# EAGLE schematic diseño_eagle_v1.7 (EAGLE 9.6.2)
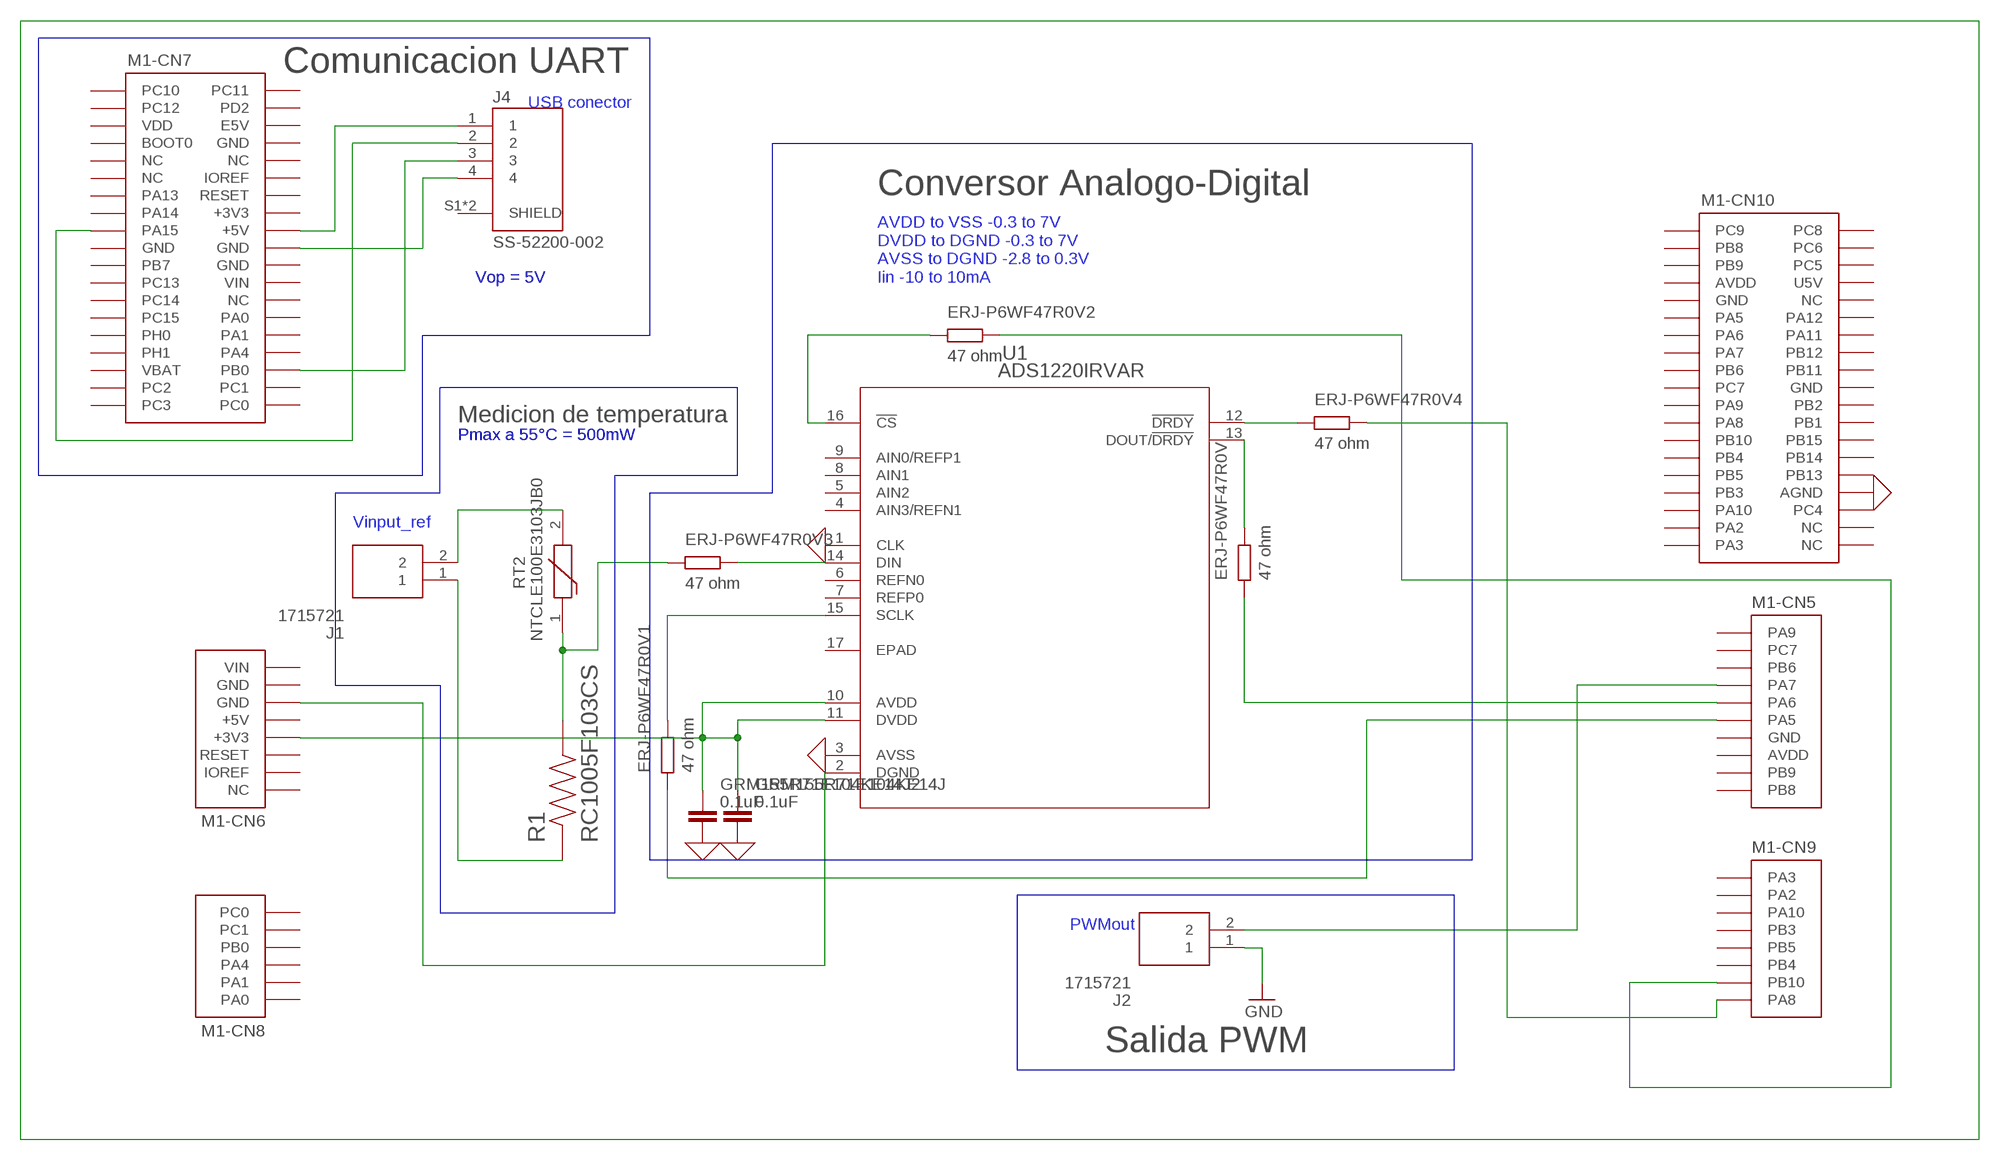
[diagram p0: schematic, sheet 1]

## Parts
ERJ-P6WF47R0V  47 ohm  R  (no package)
ERJ-P6WF47R0V1  47 ohm  R  (no package)
ERJ-P6WF47R0V2  47 ohm  R  (no package)
ERJ-P6WF47R0V3  47 ohm  R  (no package)
ERJ-P6WF47R0V4  47 ohm  R  (no package)
GRM155R71E104KE14J  0.1uF  C  (no package)
GRM155R71E104KE14J2  0.1uF  C  (no package)
J1  1715721  [1715721]
J2  1715721  [1715721]
J4  SS-52200-002  [BEL_SS-52200-002]
M1  NUCLEO-L452RE  [NUCLEO-64]
R1  RC1005F103CS  [RESC1005X40N]
RT2  NTCLE100E3103JB0  [NTCLE100E3103JB0]
U1  ADS1220IRVAR  [RVA16_2P14X2P14]

## Nets
0: GRM155R71E104KE14J2.2 GRM155R71E104KE14J.2 M1.CN10-32(-CN10:AGND) U1.1(CLK) U1.3(AVSS) ; supply symbol labelled GND
GND: J2.1
N$2: J4.1 M1.CN7-18(-CN7:+5V)
N$3: ERJ-P6WF47R0V3.1 R1.2 RT2.1
N$4: ERJ-P6WF47R0V1.1 M1.CN5-6(-CN5:PA5)
N$5: ERJ-P6WF47R0V2.2 M1.CN9-7(-CN9:PB10)
N$6: ERJ-P6WF47R0V.1 M1.CN5-5(-CN5:PA6)
N$7: GRM155R71E104KE14J2.1 GRM155R71E104KE14J.1 M1.CN6-4(-CN6:+3V3) U1.10(AVDD) U1.11(DVDD)
N$8: M1.CN6-6(-CN6:GND) U1.2(DGND)
N$9: ERJ-P6WF47R0V4.2 M1.CN9-8(-CN9:PA8)
N$10: J1.2 RT2.2
N$11: J4.2 M1.CN7-17(-CN7:PA15)
N$12: J1.1 R1.1
N$13: J4.4 M1.CN7-20(-CN7:GND)
N$14: J4.3 M1.CN7-34(-CN7:PB0)
N$15: J2.2 M1.CN5-4(-CN5:PA7)
N$16: ERJ-P6WF47R0V2.1 U1.16(!CS)
N$17: ERJ-P6WF47R0V1.2 U1.15(SCLK)
N$18: ERJ-P6WF47R0V3.2 U1.14(DIN)
N$19: ERJ-P6WF47R0V.2 U1.13(DOUT/!DRDY)
N$20: ERJ-P6WF47R0V4.1 U1.12(!DRDY)
Unconnected: J4.S1(SHIELD) J4.S2(SHIELD) M1.CN5-1(-CN5:PA9) M1.CN5-2(-CN5:PC7) M1.CN5-3(-CN5:PB6) M1.CN5-9(-CN5:PB9) M1.CN5-10(-CN5:PB8) M1.CN6-1(-CN6:NC) M1.CN6-3(-CN6:RESET) M1.CN7-1(-CN7:PC10) M1.CN7-2(-CN7:PC11) M1.CN7-3(-CN7:PC12) M1.CN7-4(-CN7:PD2) M1.CN7-6(-CN7:E5V) M1.CN7-7(-CN7:BOOT0) M1.CN7-9(-CN7:NC) M1.CN7-10(-CN7:NC) M1.CN7-11(-CN7:NC) M1.CN7-12(-CN7:IOREF) M1.CN7-13(-CN7:PA13) M1.CN7-14(-CN7:RESET) M1.CN7-15(-CN7:PA14) M1.CN7-21(-CN7:PB7) M1.CN7-23(-CN7:PC13) M1.CN7-25(-CN7:PC14) M1.CN7-26(-CN7:NC) M1.CN7-27(-CN7:PC15) M1.CN7-28(-CN7:PA0) M1.CN7-29(-CN7:PH0) M1.CN7-30(-CN7:PA1) M1.CN7-31(-CN7:PH1) M1.CN7-32(-CN7:PA4) M1.CN7-35(-CN7:PC2) M1.CN7-36(-CN7:PC1) M1.CN7-37(-CN7:PC3) M1.CN7-38(-CN7:PC0) M1.CN8-1(-CN8:PA0) M1.CN8-2(-CN8:PA1) M1.CN8-3(-CN8:PA4) M1.CN8-4(-CN8:PB0) M1.CN8-5(-CN8:PC1) M1.CN8-6(-CN8:PC0) M1.CN9-1(-CN9:PA3) M1.CN9-2(-CN9:PA2) M1.CN9-3(-CN9:PA10) M1.CN9-4(-CN9:PB3) M1.CN9-5(-CN9:PB5) M1.CN9-6(-CN9:PB4) M1.CN10-1(-CN10:PC9) M1.CN10-2(-CN10:PC8) M1.CN10-3(-CN10:PB8) M1.CN10-4(-CN10:PC6) M1.CN10-5(-CN10:PB9) M1.CN10-6(-CN10:PC5) M1.CN10-10(-CN10:NC) M1.CN10-11(-CN10:PA5) M1.CN10-12(-CN10:PA12) M1.CN10-13(-CN10:PA6) M1.CN10-14(-CN10:PA11) M1.CN10-15(-CN10:PA7) M1.CN10-16(-CN10:PB12) M1.CN10-17(-CN10:PB6) M1.CN10-18(-CN10:PB11) M1.CN10-19(-CN10:PC7) M1.CN10-21(-CN10:PA9) M1.CN10-22(-CN10:PB2) M1.CN10-23(-CN10:PA8) M1.CN10-24(-CN10:PB1) M1.CN10-25(-CN10:PB10) M1.CN10-26(-CN10:PB15) M1.CN10-27(-CN10:PB4) M1.CN10-28(-CN10:PB14) M1.CN10-29(-CN10:PB5) M1.CN10-30(-CN10:PB13) M1.CN10-31(-CN10:PB3) M1.CN10-33(-CN10:PA10) M1.CN10-34(-CN10:PC4) M1.CN10-35(-CN10:PA2) M1.CN10-36(-CN10:NC) M1.CN10-37(-CN10:PA3) M1.CN10-38(-CN10:NC) U1.4(AIN3/REFN1) U1.5(AIN2) U1.6(REFN0) U1.7(REFP0) U1.8(AIN1) U1.9(AIN0/REFP1) U1.17(EPAD)

## Buses
B$1
B$2
B$3
B$4

## Notes on the sheet
- Comunicacion UART
- USB conector
- Conversor Analogo-Digital
- Vop = 5V
- AVDD to VSS -0.3 to 7V
  DVDD to DGND -0.3 to 7V
  AVSS to DGND -2.8 to 0.3V
  Iin -10 to 10mA
- Medicion de temperatura
- Pmax a 55°C = 500mW
- Vinput_ref
- PWMout
- Salida PWM

## Power pins joined to a net without a drawn wire
+3V3: M1.CN7-16(-CN7:+3V3)
+5V: M1.CN6-5(-CN6:+5V)
AVDD: M1.CN5-8(-CN5:AVDD) M1.CN10-7(-CN10:AVDD)
GND: M1.CN5-7(-CN5:GND) M1.CN6-7(-CN6:GND) M1.CN7-8(-CN7:GND) M1.CN7-19(-CN7:GND) M1.CN7-22(-CN7:GND) M1.CN10-9(-CN10:GND) M1.CN10-20(-CN10:GND)
IOREF: M1.CN6-2(-CN6:IOREF)
U5V: M1.CN10-8(-CN10:U5V)
VBAT: M1.CN7-33(-CN7:VBAT)
VDD: M1.CN7-5(-CN7:VDD)
VIN: M1.CN6-8(-CN6:VIN) M1.CN7-24(-CN7:VIN)

## Library data of the parts
ERJ-P6WF47R0V ERJ-P6WF47R0V1-ERJ-P6WF47R0V4 = ngspice-simulation:R: RESISTOR
GRM155R71E104KE14J GRM155R71E104KE14J2 = ngspice-simulation:C: CAPACITOR
J1 J2 = 1715721:1715721: PCB terminal block, nominal current: 17.5 A, rated voltage (III/2): 400 V, nominal cross section: 1.5 mm?, Number of potentials: 2, Number of rows: 1, Number of positions per row: 2, product range: MKDS 1,5, pitch: 5.08 mm, connection method: Screw connection with tension sleeve, mounting: Wave soldering, conductor/PCB connection direction: 0 ?, color: green, Pin layout: Linear pinning, Solder pin [P]: 3.5 mm, type of packaging: packed in cardboard. The article can be aligned to create different nos. of pos Source: Datasheet <http://www.phoenixcontact.com/de/produkte/1715721/pdf>; DESCRIPTION: PCB terminal block, nominal current: 17.5 A, rated voltage (III/2): 400 V, nominal cross section: 1.5 mm?, Number of potentials: 2, Number of rows: 1, Number of positions per row: 2, product range: MKDS 1,5, pitch: 5.08 mm, connection method: Screw connection with tension sleeve, mounting: Wave soldering, conductor/PCB connection direction: 0 ?, color: green, Pin layout: Linear pinning, Solder pin [P]: 3.5 mm, type of packaging: packed in cardboard. The article can be aligned to create different nos. of pos; HEIGHT: 13.95mm; MANUFACTURER_NAME: Phoenix Contact; MANUFACTURER_PART_NUMBER: 1715721
J4 = SS-52200-002:SS-52200-002: IP67 Single Port Right Angle USB 2.0 SealJack with #4-40 Threads Check availability <https://pricing.snapeda.com/parts/SS-52200-002/Bel%20Fuse/view-part?ref=eda>; AVAILABILITY: In Stock; CHECK_PRICES: https://www.snapeda.com/parts/SS-52200-002/Bel+Fuse/view-part/?ref=eda; DESCRIPTION: Connector USB Type A Jack 4 Position Right Angle; MF: Bel Fuse; MP: SS-52200-002; PACKAGE: None; PRICE: None; SNAPEDA_LINK: https://www.snapeda.com/parts/SS-52200-002/Bel+Fuse/view-part/?ref=snap
M1 = NUCLEO-L452RE:NUCLEO-L452RE: No existe un outline (Layer Dimension) para esta librería. En su lugar se utilizó una referencia en tDocu. Al momento de diseñar la tarjeta, el Dimension debe ser dibujado según los requerimientos del usuario, o simplemente copiar los contenidos del tDocu en Dimensions.
R1 = RC1005F103CS:RC1005F103CS: Check availability <https://pricing.snapeda.com/parts/RC1005F103CS/Samsung%20Electro-Mechanics/view-part?ref=eda>; AVAILABILITY: In Stock; CHECK_PRICES: https://www.snapeda.com/parts/RC1005F103CS/Samsung+Electro-Mechanics/view-part/?ref=eda; DESCRIPTION: 10 kOhms ±1% 0.063W, 1/16W Chip Resistor 0402 (1005 Metric) Moisture Resistant Thick Film; MF: Samsung Electro-Mechanics; MP: RC1005F103CS; PACKAGE: 1005 Panasonic Electronic Components; PRICE: None; PURCHASE-URL: https://www.snapeda.com/api/url_track_click_mouser/?unipart_id=579623&manufacturer=Samsung Electro-Mechanics&part_name=RC1005F103CS&search_term=rc1005f103cs; SNAPEDA_LINK: https://www.snapeda.com/parts/RC1005F103CS/Samsung+Electro-Mechanics/view-part/?ref=snap
RT2 = NTCLE100E3103JB0:NTCLE100E3103JB0: Vishay NTCLE100E3103JB0 Thermistor 10k, 3.3 x 3 x 9mm Source: Datasheet; DESCRIPTION: Vishay NTCLE100E3103JB0 Thermistor 10k, 3.3 x 3 x 9mm; HEIGHT: 10mm; MANUFACTURER_NAME: Vishay; MANUFACTURER_PART_NUMBER: NTCLE100E3103JB0
U1 = ADS12:ADS1220IRVAR; COPYRIGHT: Copyright (C) 2023 Ultra Librarian. All rights reserved.; MANUFACTURER_PART_NUMBER: ADS1220IRVAR; MFR_NAME: Texas Instruments